# EAGLE design TapClip.v3 (EAGLE 6.2)
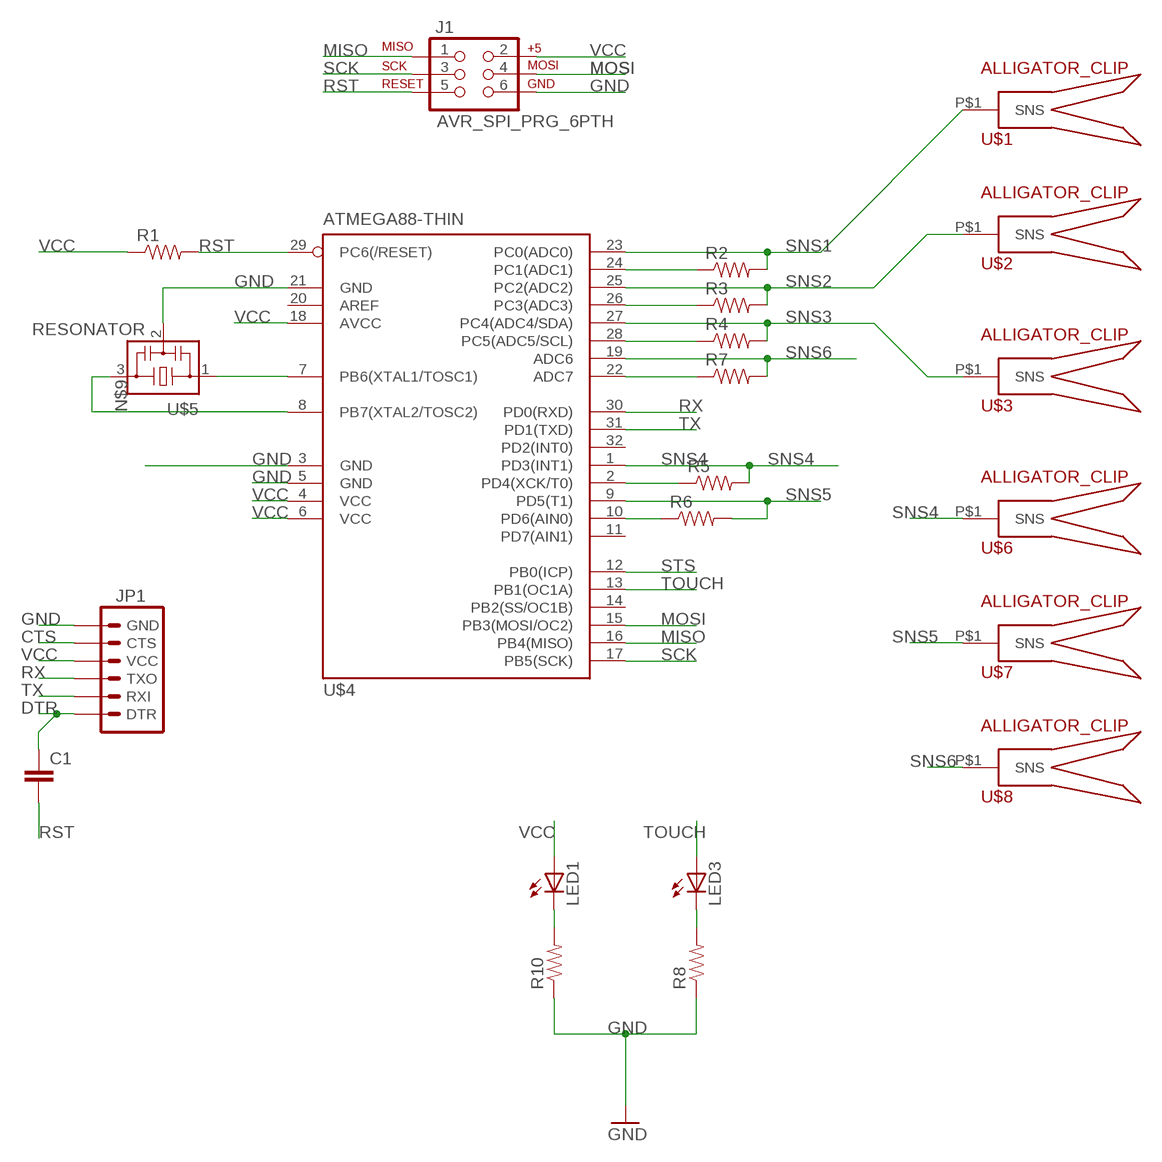
[diagram p0: schematic, sheet 1]

## Parts
C1  CAP0603-CAP  [0603-CAP]
J1  AVR_SPI_PRG_6PTH  [2X3]
JP1  ARDUINO_SERIAL_PROGRAMSMD  [1X06-SMD]
LED1  LED1206  [LED-1206]
LED3  LED1206  [LED-1206]
R1  RESISTOR0603-RES  [0603-RES]
R2  RESISTOR0603-RES  [0603-RES]
R3  RESISTOR0603-RES  [0603-RES]
R4  RESISTOR0603-RES  [0603-RES]
R5  RESISTOR0603-RES  [0603-RES]
R6  RESISTOR0603-RES  [0603-RES]
R7  RESISTOR0603-RES  [0603-RES]
R8  RESISTOR1206  [1206]
R10  RESISTOR1206  [1206]
U$1  ALLIGATOR_CLIP  [ALLIGATOR_CLIP]
U$2  ALLIGATOR_CLIP  [ALLIGATOR_CLIP]
U$3  ALLIGATOR_CLIP  [ALLIGATOR_CLIP]
U$4  ATMEGA88-THIN  [TQFP32-08THIN]
U$5  RESONATOR  [EFOBM]
U$6  ALLIGATOR_CLIP  [ALLIGATOR_CLIP]
U$7  ALLIGATOR_CLIP  [ALLIGATOR_CLIP]
U$8  ALLIGATOR_CLIP  [ALLIGATOR_CLIP]

## Nets
CTS: JP1.5(CTS)
DTR: C1.1 JP1.1(DTR)
GND: J1.6 JP1.6(GND) R8.1 R10.1 U$4.3(GND) U$4.5(GND) U$4.21(GND) U$5.2
MISO: J1.1 U$4.16(PB4(MISO))
MOSI: J1.4 U$4.15(PB3(MOSI/OC2))
N$2: R2.1 U$4.24(PC1(ADC1))
N$3: LED1.C R10.2
N$4: R3.1 U$4.26(PC3(ADC3))
N$6: R4.1 U$4.28(PC5(ADC5/SCL))
N$7: LED3.C R8.2
N$9: U$4.8(PB7(XTAL2/TOSC2)) U$5.3
N$10: U$4.7(PB6(XTAL1/TOSC1)) U$5.1
N$21: R5.1 U$4.2(PD4(XCK/T0))
N$22: R6.1 U$4.10(PD6(AIN0))
N$23: R7.1 U$4.22(ADC7)
RST: C1.2 J1.5 R1.2 U$4.29(PC6(/RESET))
RX: JP1.3(TXO) U$4.30(PD0(RXD))
SCK: J1.3 U$4.17(PB5(SCK))
SNS1: R2.2 U$1.P$1(SNS) U$4.23(PC0(ADC0))
SNS2: R3.2 U$2.P$1(SNS) U$4.25(PC2(ADC2))
SNS3: R4.2 U$3.P$1(SNS) U$4.27(PC4(ADC4/SDA))
SNS4: R5.2 U$4.1(PD3(INT1)) U$6.P$1(SNS)
SNS5: R6.2 U$4.9(PD5(T1)) U$7.P$1(SNS)
SNS6: R7.2 U$4.19(ADC6) U$8.P$1(SNS)
STS: U$4.12(PB0(ICP))
TOUCH: LED3.A U$4.13(PB1(OC1A))
TX: JP1.2(RXI) U$4.31(PD1(TXD))
VCC: J1.2 JP1.4(VCC) LED1.A R1.1 U$4.4(VCC) U$4.6(VCC) U$4.18(AVCC)
Unconnected: U$4.11(PD7(AIN1)) U$4.14(PB2(SS/OC1B)) U$4.20(AREF) U$4.32(PD2(INT0))

## Library data of the parts
C1 = SparkFun:CAP: Capacitor Standard 0603 ceramic capacitor, and 0.1" leaded capacitor.
J1 = SparkFun:AVR_SPI_PRG_6: AVR ISP 6 Pin This is the reduced ISP connector for AVR programming. Common on Arduino. This footprint will take up less PCB space and can be used with a 10-pin to 6-pin adapter such as SKU: BOB-08508
JP1 = sdgj:ARDUINO_SERIAL_PROGRAM: FTDI connector footprints
LED1 LED3 = SparkFun:LED: LEDs Standard schematic elements and footprints for 5mm, 3mm, 1206, and 0603 sized LEDs. 5mm - Spark Fun Electronics SKU : COM-00529 (and others)
R1-R8 R10 = SparkFun:RESISTOR: Resistor Basic schematic elements and footprints for 0603, 1206, and PTH resistors.
U$1-U$3 U$6-U$8 = sdgj:ALLIGATOR_CLIP
U$4 = fab:ATMEGA88-THIN
U$5 = fab:RESONATOR

## Board
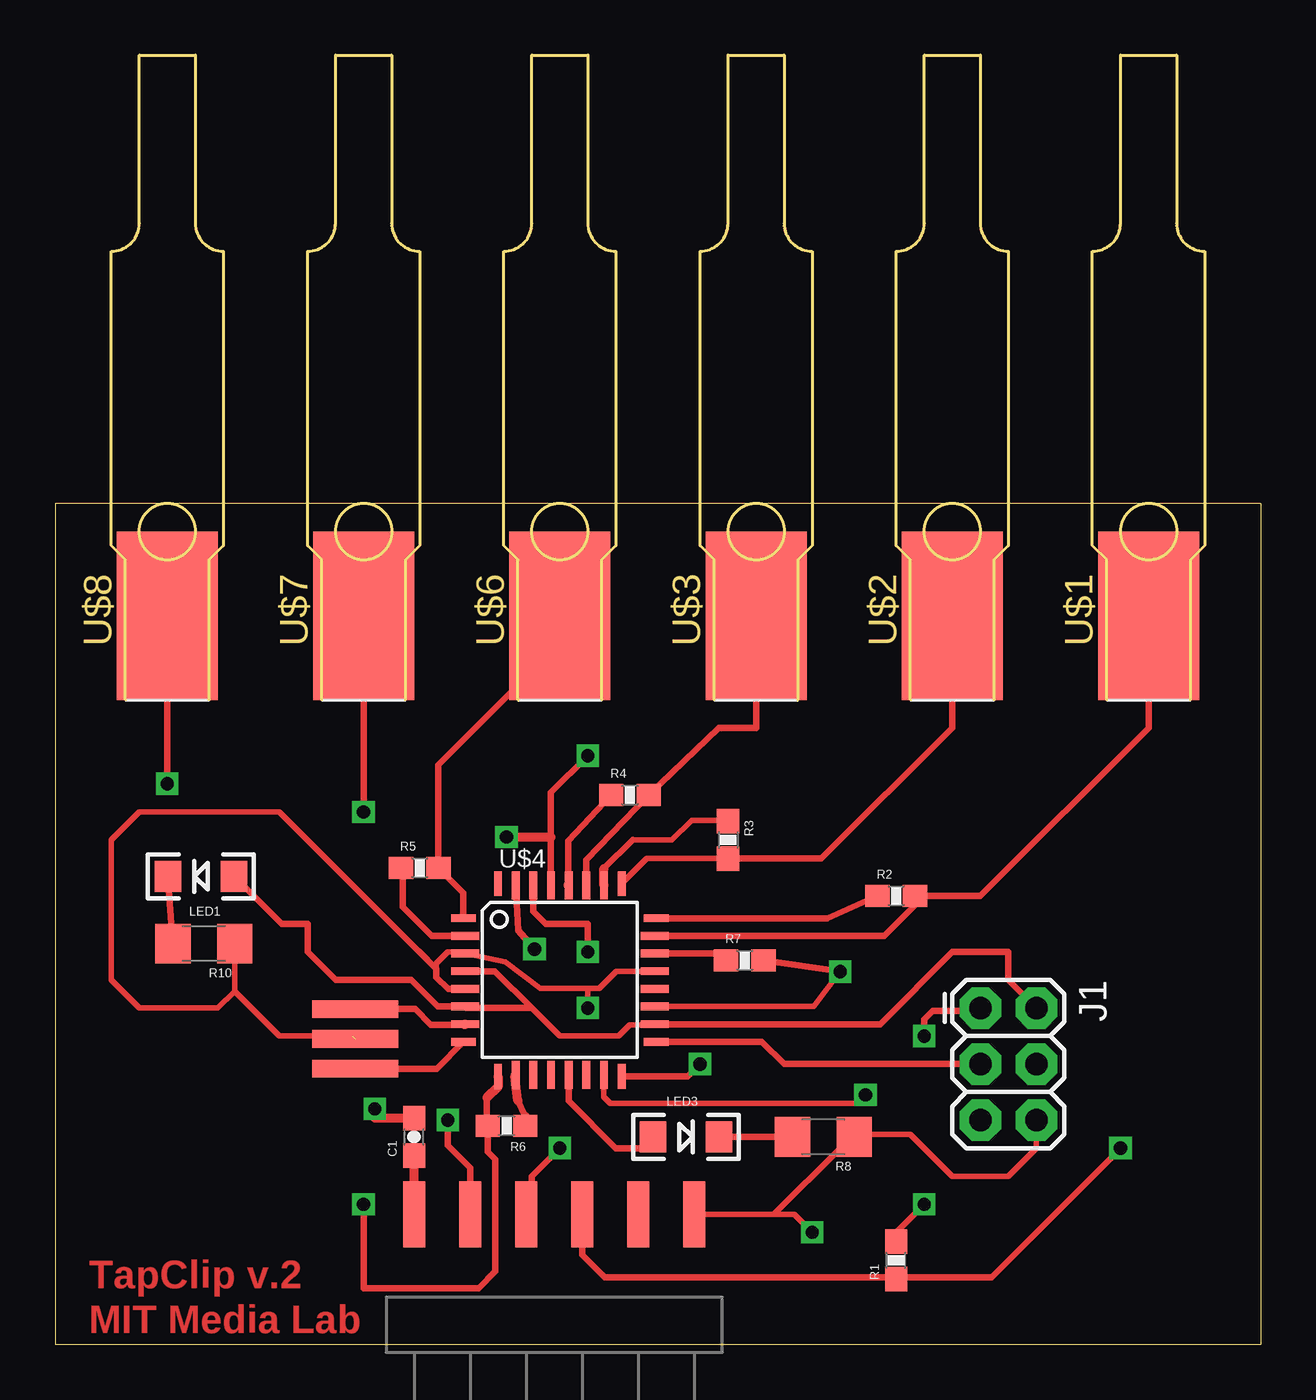
[diagram p1: board, top side]
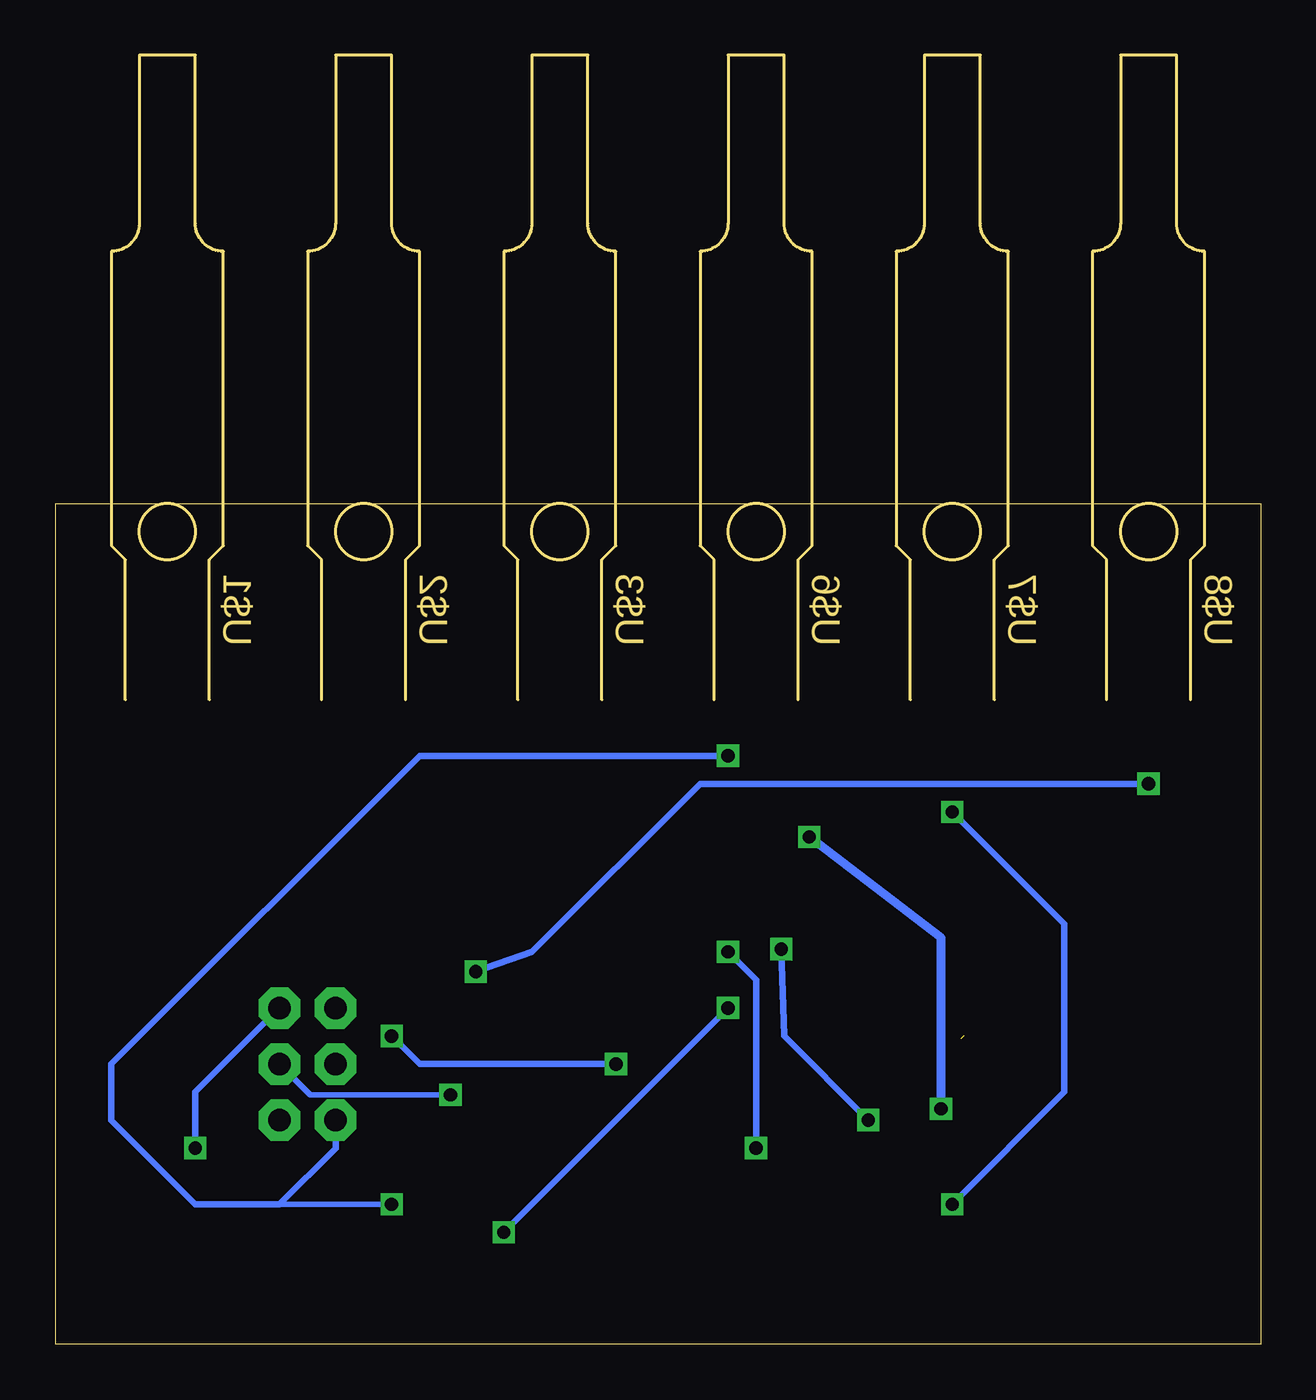
[diagram p2: board, bottom side, seen from below]

Size 54.61 x 38.1 mm. Coordinates in mm from the lower left corner, seen from the top.
Outline: 0,0 54.61,0 54.61,38.1 0,38.1 0,0
Copper layers (1*16): Top 0.035mm / dielectric 1.5mm / Bottom 0.035mm
Design rules: minimum track width 10mil, minimum drill 24mil, track to track 8mil, track to pad 8mil, pad to pad 8mil, via to via 8mil, smd to smd 8mil, copper to edge 40mil, drill to drill 8mil, minimum pad ring 10mil, minimum via ring 8mil, stop-mask expansion 4mil, vias tented up to drill 0mil, thermal gap 10mil

### Footprints (pad centres in the part's own frame; a part is rotated, then mirrored left to right if it is on the bottom)
0603-CAP = smd 1.1 x 1: 1 -0.85,0; 2 0.85,0
2X3 = drill 1.016 pad 1.88 octagon: 1 0,0; 2 0,2.54; 3 2.54,0; 4 2.54,2.54; 5 5.08,0; 6 5.08,2.54
1X06-SMD = smd 1 x 3: 1 -6.35,5; 2 -3.81,5; 3 -1.27,5; 4 1.27,5; 5 3.81,5; 6 6.35,5
LED-1206 = smd 1.2 x 1.4: A -1.5,0; C 1.5,0
0603-RES = smd 1.1 x 1: 1 -0.85,0; 2 0.85,0
1206 = smd 1.6 x 1.8: 1 -1.4,0; 2 1.4,0
ALLIGATOR_CLIP = smd 7.62 x 4.572: P$1 0,0
TQFP32-08THIN = smd 1.118 x 0.356: 1 -4.369,2.8; 8 -4.369,-2.8; 17 4.369,-2.8; 24 4.369,2.8 | smd 1.27 x 0.356: 2 -4.293,2; 3 -4.293,1.2; 4 -4.293,0.4; 5 -4.293,-0.4; 6 -4.293,-1.2; 7 -4.293,-2; 18 4.293,-2; 19 4.293,-1.2; 20 4.293,-0.4; 21 4.293,0.4; 22 4.293,1.2; 23 4.293,2 | smd 0.356 x 1.118: 9 -2.8,-4.369; 16 2.8,-4.369; 25 2.8,4.369; 32 -2.8,4.369 | smd 0.356 x 1.27: 10 -2,-4.293; 14 1.2,-4.293; 15 2,-4.293; 26 2,4.293; 27 1.2,4.293; 31 -2,4.293 | smd 0.35 x 1.27: 11 -1.2,-4.293; 12 -0.4,-4.293; 13 0.4,-4.293; 28 0.4,4.293; 29 -0.4,4.293; 30 -1.2,4.293
EFOBM = smd 0.8 x 3.9: 1 -1.35,0; 2 0,0; 3 1.35,0

### Placement (x,y rotation side)
C1  16.26,9.4 90 top
J1  41.91,15.24 270 top
JP1  22.61,0.89 0 top
LED1  6.6,21.21 180 top
LED3  28.58,9.4 0 top
R1  38.1,3.81 90 top
R2  38.1,20.32 0 top
R3  30.48,22.86 270 top
R4  26.04,24.89 0 top
R5  16.51,21.59 0 top
R6  20.45,9.91 180 top
R7  31.24,17.4 0 top
R8  34.8,9.4 180 top
R10  6.73,18.16 180 top
U$1  49.53,33.02 90 top
U$2  40.64,33.02 90 top
U$3  31.75,33.02 90 top
U$4  22.86,16.51 0 top
U$5  13.59,13.84 270 top
U$6  22.86,33.02 90 top
U$7  13.97,33.02 90 top
U$8  5.08,33.02 90 top

### Tracks (layer width: path | path; a pad name or v marks a point on that pad's centre or on a via)
DTR
  Top 0.406: JP1.1 C1.1
GND  (via drill 0.6)  (1 unrouted)
  Top 0.254: R10.1 8.13,16 | 8.13,16 10.16,13.97 13.46,13.97 | 8.13,16 7.37,15.24 3.81,15.24 2.54,16.51 2.54,22.86 3.81,24.13 10.16,24.13 17.27,17.02 17.27,17.27 17.78,17.78 18.5,17.78 U$4.3 20.39,17.33 21.97,16.13 24.13,16.13 | U$4.21 25.42,16.91 24.64,16.13 24.13,16.13 | v34.29,5.08 33.48,5.89 JP1.6 32.56,5.89 35.56,8.89 35.69,8.89 R8.1 36.33,9.53 38.73,9.53 40.64,7.62 43.18,7.62 44.45,8.89 J1.6 | v24.13,15.24 24.13,16.13
  Top 0.305: R8.1 36.2,9.53 36.83,10.16 | U$4.5 17.8,16.11 17.27,16.64 17.27,17.02 16.51,17.78
  Bottom 0.254: v34.29,5.08 v24.13,15.24
MISO  (via drill 0.6)
  Top 0.305: U$4.16 28.65,12.14 v29.21,12.7 | v39.37,13.97 39.37,14.73 39.75,15.11 41.78,15.11 J1.1
  Bottom 0.305: v29.21,12.7 38.1,12.7 v39.37,13.97
MOSI  (via drill 0.6)
  Top 0.254: U$4.15 24.86,11.21 25.15,10.92 36.32,10.92 v36.7,11.3
  Bottom 0.254: v36.7,11.3 43.05,11.3 J1.4
N$2
  Top 0.305: U$4.24 34.97,19.31 R2.1
N$3
  Top 0.305: LED1.C R10.2
N$4
  Top 0.254: 26.16,22.86 27.94,22.86 28.83,23.75 30.44,23.75
  Top 0.305: 24.86,21.56 26.16,22.86
  Top 0.406: U$4.26 24.86,21.56 | 30.44,23.75 R3.1
N$6
  Top 0.305: 23.24,20.8 23.24,22.82 R4.1
  Top 0.406: U$4.28 23.24,20.8
N$7
  Top 0.305: LED3.C R8.2
N$9
  Top 0.305: U$5.3 17.27,12.49 U$4.8
N$10
  Top 0.305: 18.54,14.48 17.02,14.48 16.3,15.19 U$5.1
  Top 0.406: 18.54,14.48 U$4.7
N$21
  Top 0.305: U$4.2 17.05,18.51 15.75,19.81 15.75,21.5 R5.1
N$22
  Top 0.305: 21.3,10.33 20.95,11.05
  Top 0.406: R6.1 21.3,10.33 | 20.95,11.05 20.83,12.18 U$4.10
N$23
  Top 0.305: U$4.22 30.08,17.71 R7.1
RST  (via drill 0.6)
  Top 0.254: R1.2 38.1,5.08 v39.37,6.35
  Top 0.305: 22.46,22.84 U$4.29 22.46,22.99 22.46,25 v24.13,26.67
  Top 0.406: C1.2 14.48,10.25 v14.48,10.67 | v20.45,22.99 22.46,22.99
  Bottom 0.254: v39.37,6.35 44.45,6.35
  Bottom 0.305: v24.13,26.67 38.1,26.67 52.07,12.7 52.07,10.16 48.26,6.35 44.45,6.35 41.91,8.89 J1.5
  Bottom 0.406: v14.48,10.67 14.48,18.41 v20.45,22.99
RX  (via drill 0.6)
  Top 0.305: JP1.3 21.34,6.1 21.59,6.35 21.59,7.62 v22.86,8.89 | v24.13,17.78 24.13,19.05 22.23,19.05 21.66,19.61 U$4.30
  Bottom 0.305: v22.86,8.89 22.86,16.51 v24.13,17.78
SCK
  Top 0.305: U$4.17 32.01,13.71 33.02,12.7 J1.3
SNS1
  Top 0.254: R2.2 39.01,20.22 39.32,20.22 39.29,20.24
  Top 0.305: U$4.23 37.56,18.51 39.29,20.24 39.37,20.32 41.91,20.32 49.53,27.94 U$1.P$1
SNS2
  Top 0.254: R3.2 26.79,22.01 U$4.25
  Top 0.305: U$2.P$1 40.64,27.94 34.71,22.01 R3.2
SNS3
  Top 0.305: U$3.P$1 31.75,27.94 30.06,27.94 R4.2 24.06,21.94 U$4.27
SNS4
  Top 0.305: U$4.1 18.49,20.46 R5.2 17.36,26.25 22.86,31.75 U$6.P$1
SNS5  (via drill 0.6)
  Top 0.305: U$7.P$1 v13.97,24.13 | 19.56,11.18 19.56,9.95 | v13.97,6.35 13.97,2.54 19.18,2.54 19.94,3.3 19.94,8.38 19.6,8.72 R6.2
  Top 0.406: U$4.9 20.06,11.68 19.56,11.18 | 19.56,9.95 R6.2
  Bottom 0.305: v13.97,24.13 8.89,19.05 8.89,11.43 v13.97,6.35
SNS6  (via drill 0.6)
  Top 0.254: U$4.19 34.36,15.31 v35.56,16.89
  Top 0.305: U$8.P$1 v5.08,25.4 | R7.2 v35.56,16.89
  Bottom 0.305: v5.08,25.4 25.4,25.4 33.02,17.78 v35.56,16.89
TOUCH
  Top 0.305: U$4.13 23.26,11.03 25.4,8.89 26.57,8.89 LED3.A
TX  (via drill 0.6)
  Top 0.305: U$4.31 20.99,18.76 v21.72,17.91 | v17.78,10.16 17.78,9.02 18.8,8 JP1.2
  Bottom 0.305: v21.72,17.91 21.59,13.97 v17.78,10.16
VCC  (via drill 0.6)
  Top 0.254: 21.59,15.24 22.86,13.97 25.53,13.97 26.04,14.48 28.04,14.48 28.07,14.51 | R1.1 38.27,2.96 38.35,3.05
  Top 0.305: U$4.18 28.07,14.51 37.37,14.51 40.64,17.78 43.18,17.78 43.18,16.51 J1.2 | U$4.4 19.92,16.91 21.59,15.24 18.64,15.24 U$4.6 17.33,15.31 16.13,16.51 12.7,16.51 11.43,17.78 11.43,19.05 10.26,19.05 LED1.A | JP1.4 23.88,4.06 24.89,3.05 38.35,3.05 42.42,3.05 v48.26,8.89
  Bottom 0.305: v48.26,8.89 48.26,11.43 J1.2

### Text on the board
Top: TapClip v.2 | MIT Media Lab